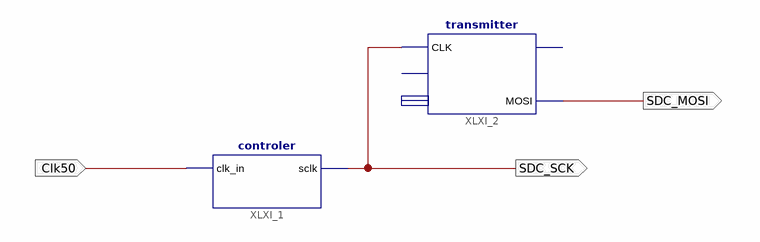
[diagram p0: schematic sheet 1]
// Xilinx ISE schematic main.sch (spartan3e) as structural Verilog: 2 symbols, 3 ports
module main (
  input  Clk50,
  output SDC_SCK,
  output SDC_MOSI
);

  controler XLXI_1 (.clk_in(Clk50), .sclk(SDC_SCK));
  transmitter XLXI_2 (.CLK(SDC_SCK), .MOSI(SDC_MOSI));  // open: TX_BGN, CMD_IN, TX_END
endmodule
